# EasyEDA schematic PWM_Presence_Detection.json
TITLE: PWM Presence Detection; REV: 1.0; Date: 2022-05-20; Sheet: 1/1; Drawn By: brentonadey; Company: SIT730
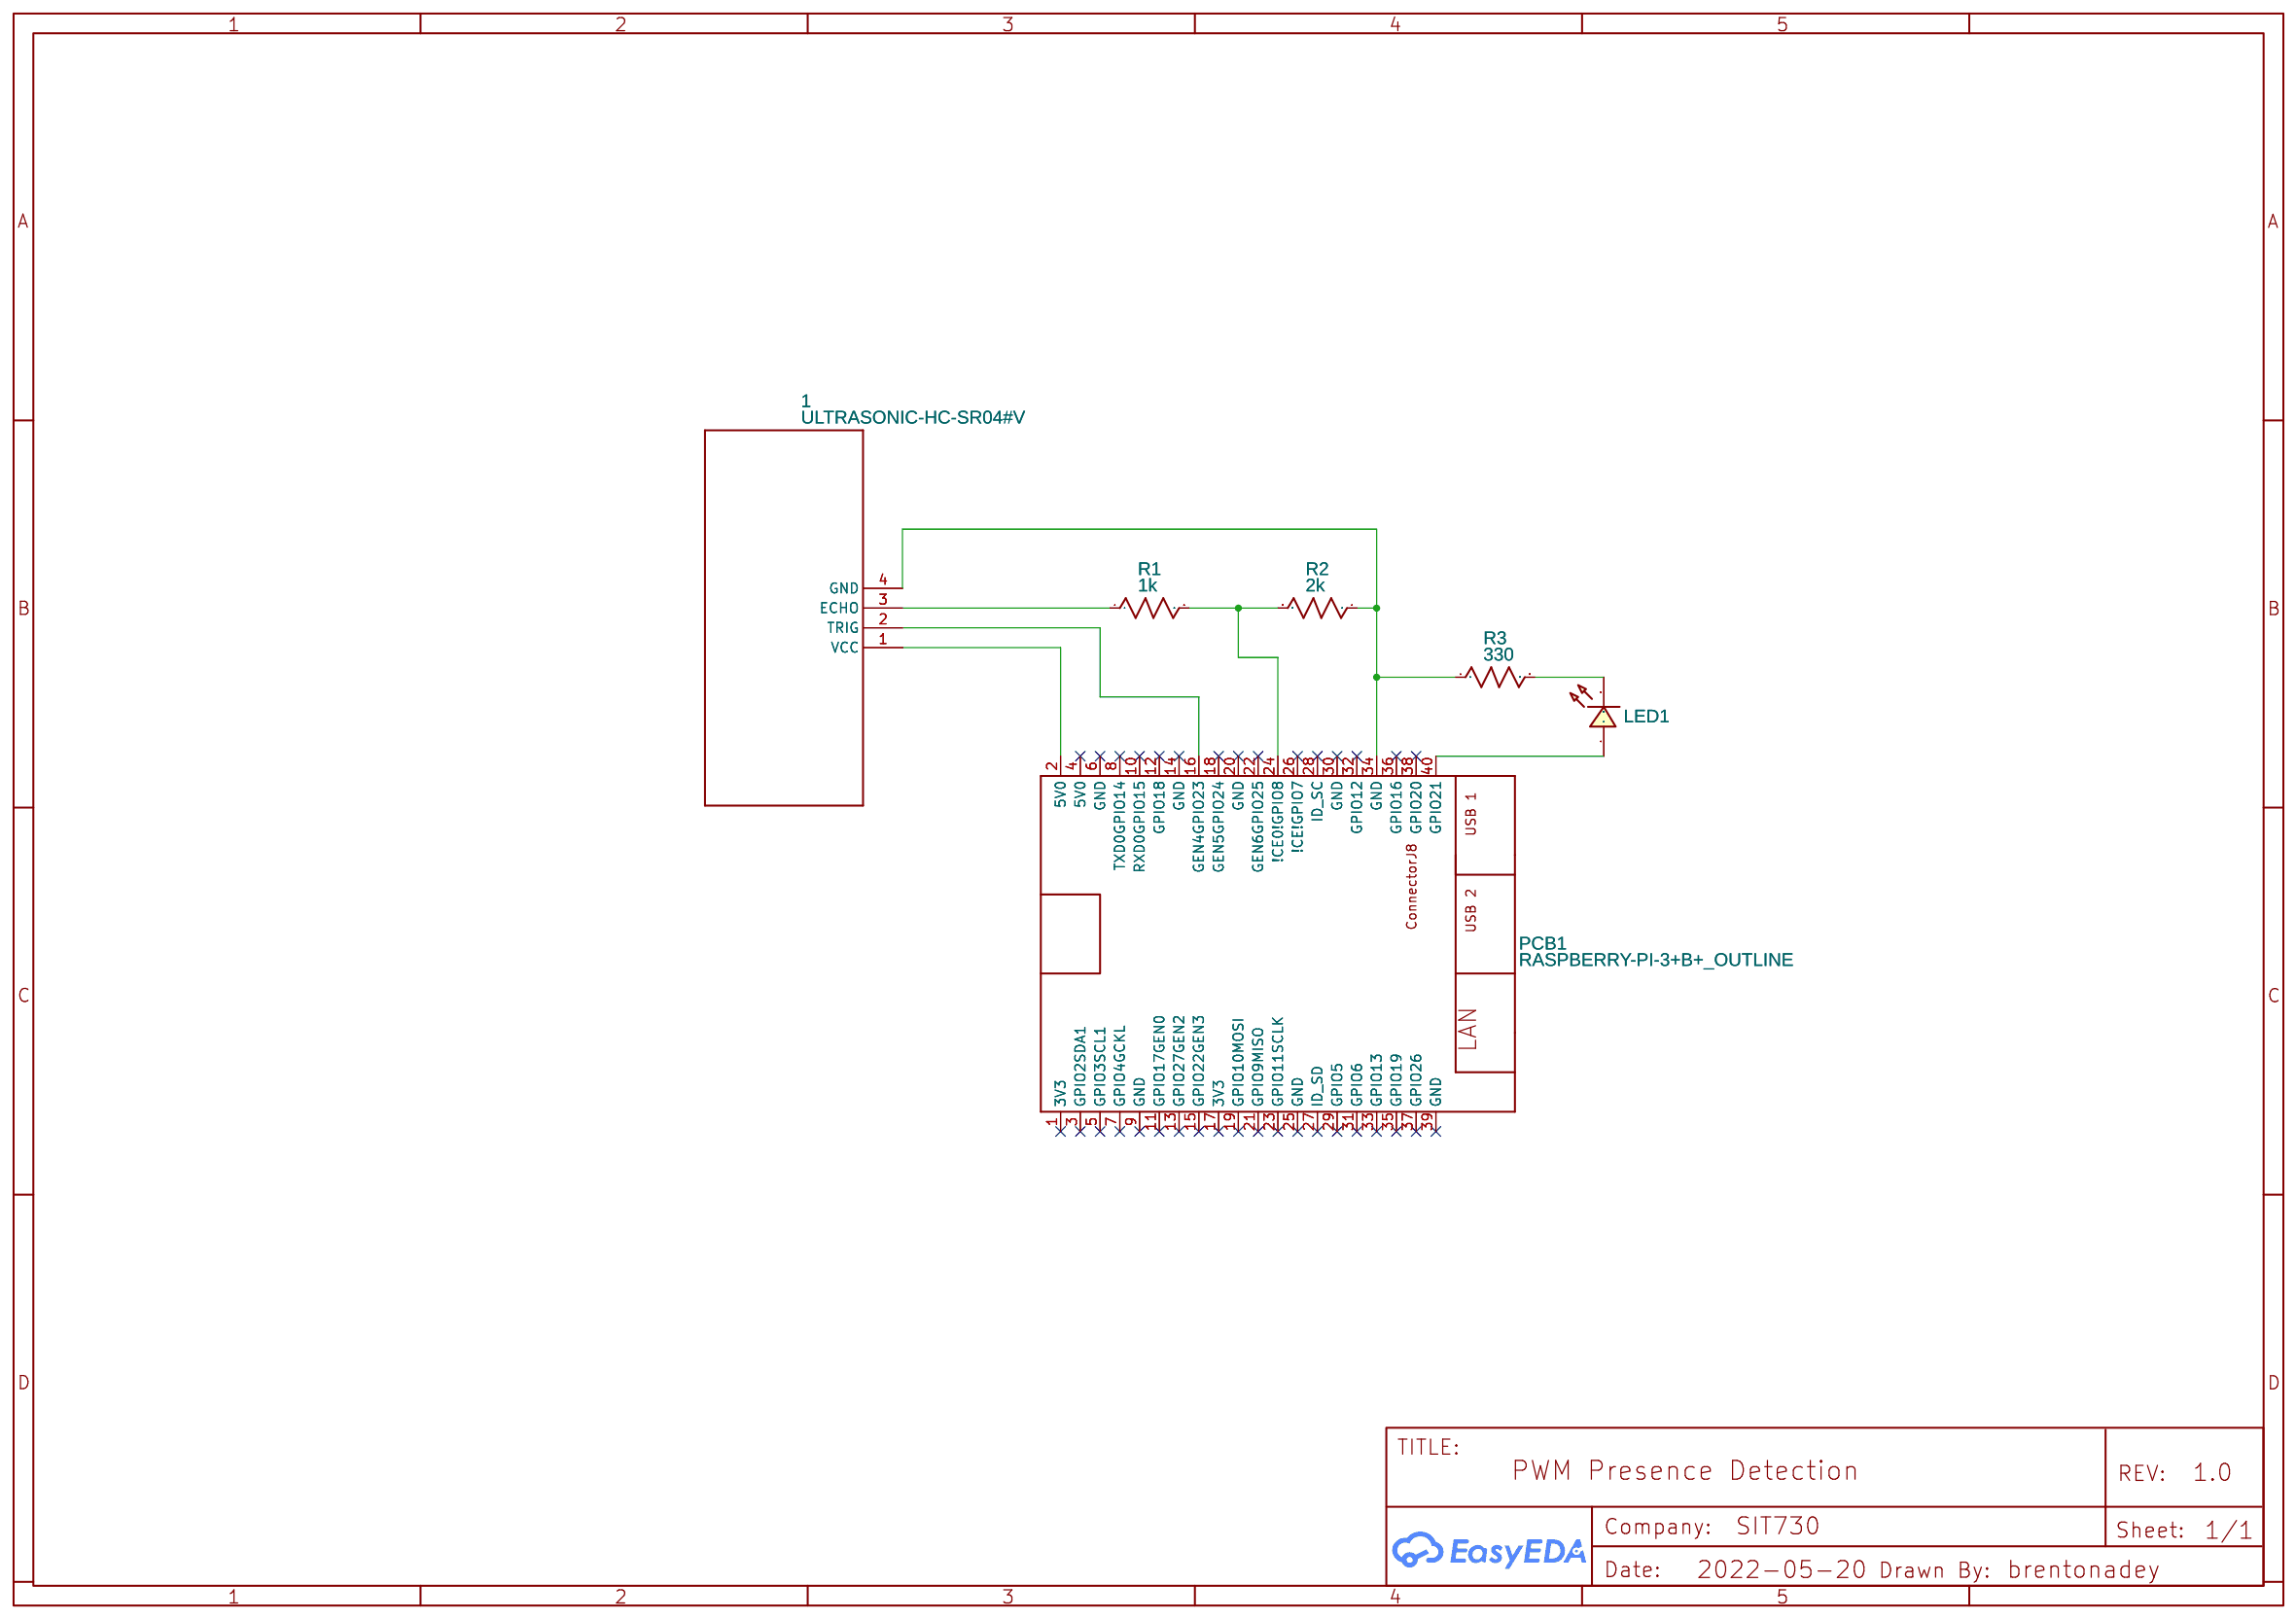
[diagram p0: schematic sheet]

## Parts
1  ULTRASONIC-HC-SR04#V  [ULTRASONIC-HC-SR04#V]
LED1  LED-0603_B  [LED0603_BLUE]
PCB1  RASPBERRY-PI-3+B+_OUTLINE  [RASPBERRY_BI_3B+_SMALL_HOLES_OUTLINE_MOUNT]
R1  1k  [R0603]
R2  2k  [R0603]
R3  330  [R0603]

## Library data of the parts
1 = ULTRASONIC-HC-SR04#V: Contributor: Thafhan Fathur Rahman
LED1 = LED-0603_B: Manufacturer: EVERLIGHT(台湾亿光); Manufacturer Part: 19-217/BHC-ZL1M2RY/3T; Supplier Part: C72041; Supplier: LCSC; Contributor: LCEDA_01
PCB1 = RASPBERRY-PI-3+B+_OUTLINE: Raspberry Pi B+; sourceId: jNnXjhecy; Supplier: Ingun; Contributor: Schamzee
R1-R3 = R_0603_US: Contributor: LCEDA_Lib

## Nets
Net-(1-1): 1.1(VCC) PCB1.2(5V0)
Net-(1-2): 1.2(TRIG) PCB1.16(GEN4GPIO23)
Net-(1-3): 1.3(ECHO) R1.1
Net-(1-4): 1.4(GND) PCB1.34(GND) R2.1 R3.1
Net-(LED1-1): LED1.1 PCB1.40(GPIO21)
Net-(LED1-2): LED1.2 R3.2
Net-(PCB1-24): PCB1.24(!CE0!GPIO8) R1.2 R2.2

Not connected (* = marked no-connect by the designer): PCB1 1(3V3)* 3(GPIO2SDA1)* 4(5V0)* 5(GPIO3SCL1)* 6(GND)* 7(GPIO4GCKL)* 8(TXD0GPIO14)* 9(GND)* 10(RXD0GPIO15)* 11(GPIO17GEN0)* 12(GPIO18)* 13(GPIO27GEN2)* 14(GND)* 15(GPIO22GEN3)* 17(3V3)* 18(GEN5GPIO24)* 19(GPIO10MOSI)* 20(GND)* 21(GPIO9MISO)* 22(GEN6GPIO25)* 23(GPIO11SCLK)* 25(GND)* 26(!CE!GPIO7)* 27(ID_SD)* 28(ID_SC)* 29(GPIO5)* 30(GND)* 31(GPIO6)* 32(GPIO12)* 33(GPIO13)* 35(GPIO19)* 36(GPIO16)* 37(GPIO26)* 38(GPIO20)* 39(GND)*
